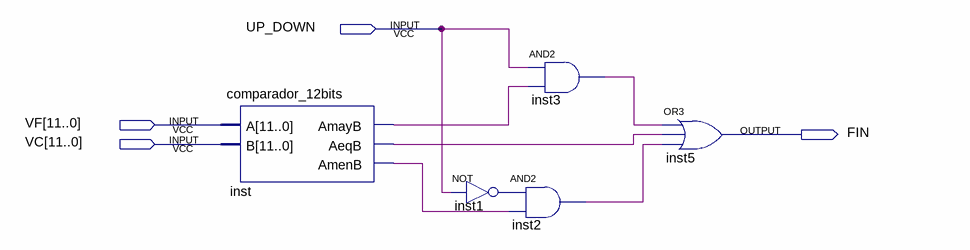
[diagram p0: schematic sheet]
// Quartus schematic UC_detector_fin.bdf as structural Verilog: 5 symbols, 4 pins
module UC_detector_fin (
  input  UP_DOWN,
  input  [11:0] VF,
  input  [11:0] VC,
  output FIN
);

  wire inst1_out, inst2_out, inst3_out, inst_aeqb, inst_amayb, inst_amenb;

  comparador_12bits inst (.A(VF), .B(VC), .AmayB(inst_amayb), .AeqB(inst_aeqb), .AmenB(inst_amenb));
  not inst1 (inst1_out, UP_DOWN);
  and inst3 (inst3_out, UP_DOWN, inst_amayb);
  and inst2 (inst2_out, inst1_out, inst_amenb);
  or inst5 (FIN, inst3_out, inst_aeqb, inst2_out);
endmodule
